# EAGLE design spachausgabe (EAGLE 7.3.0)
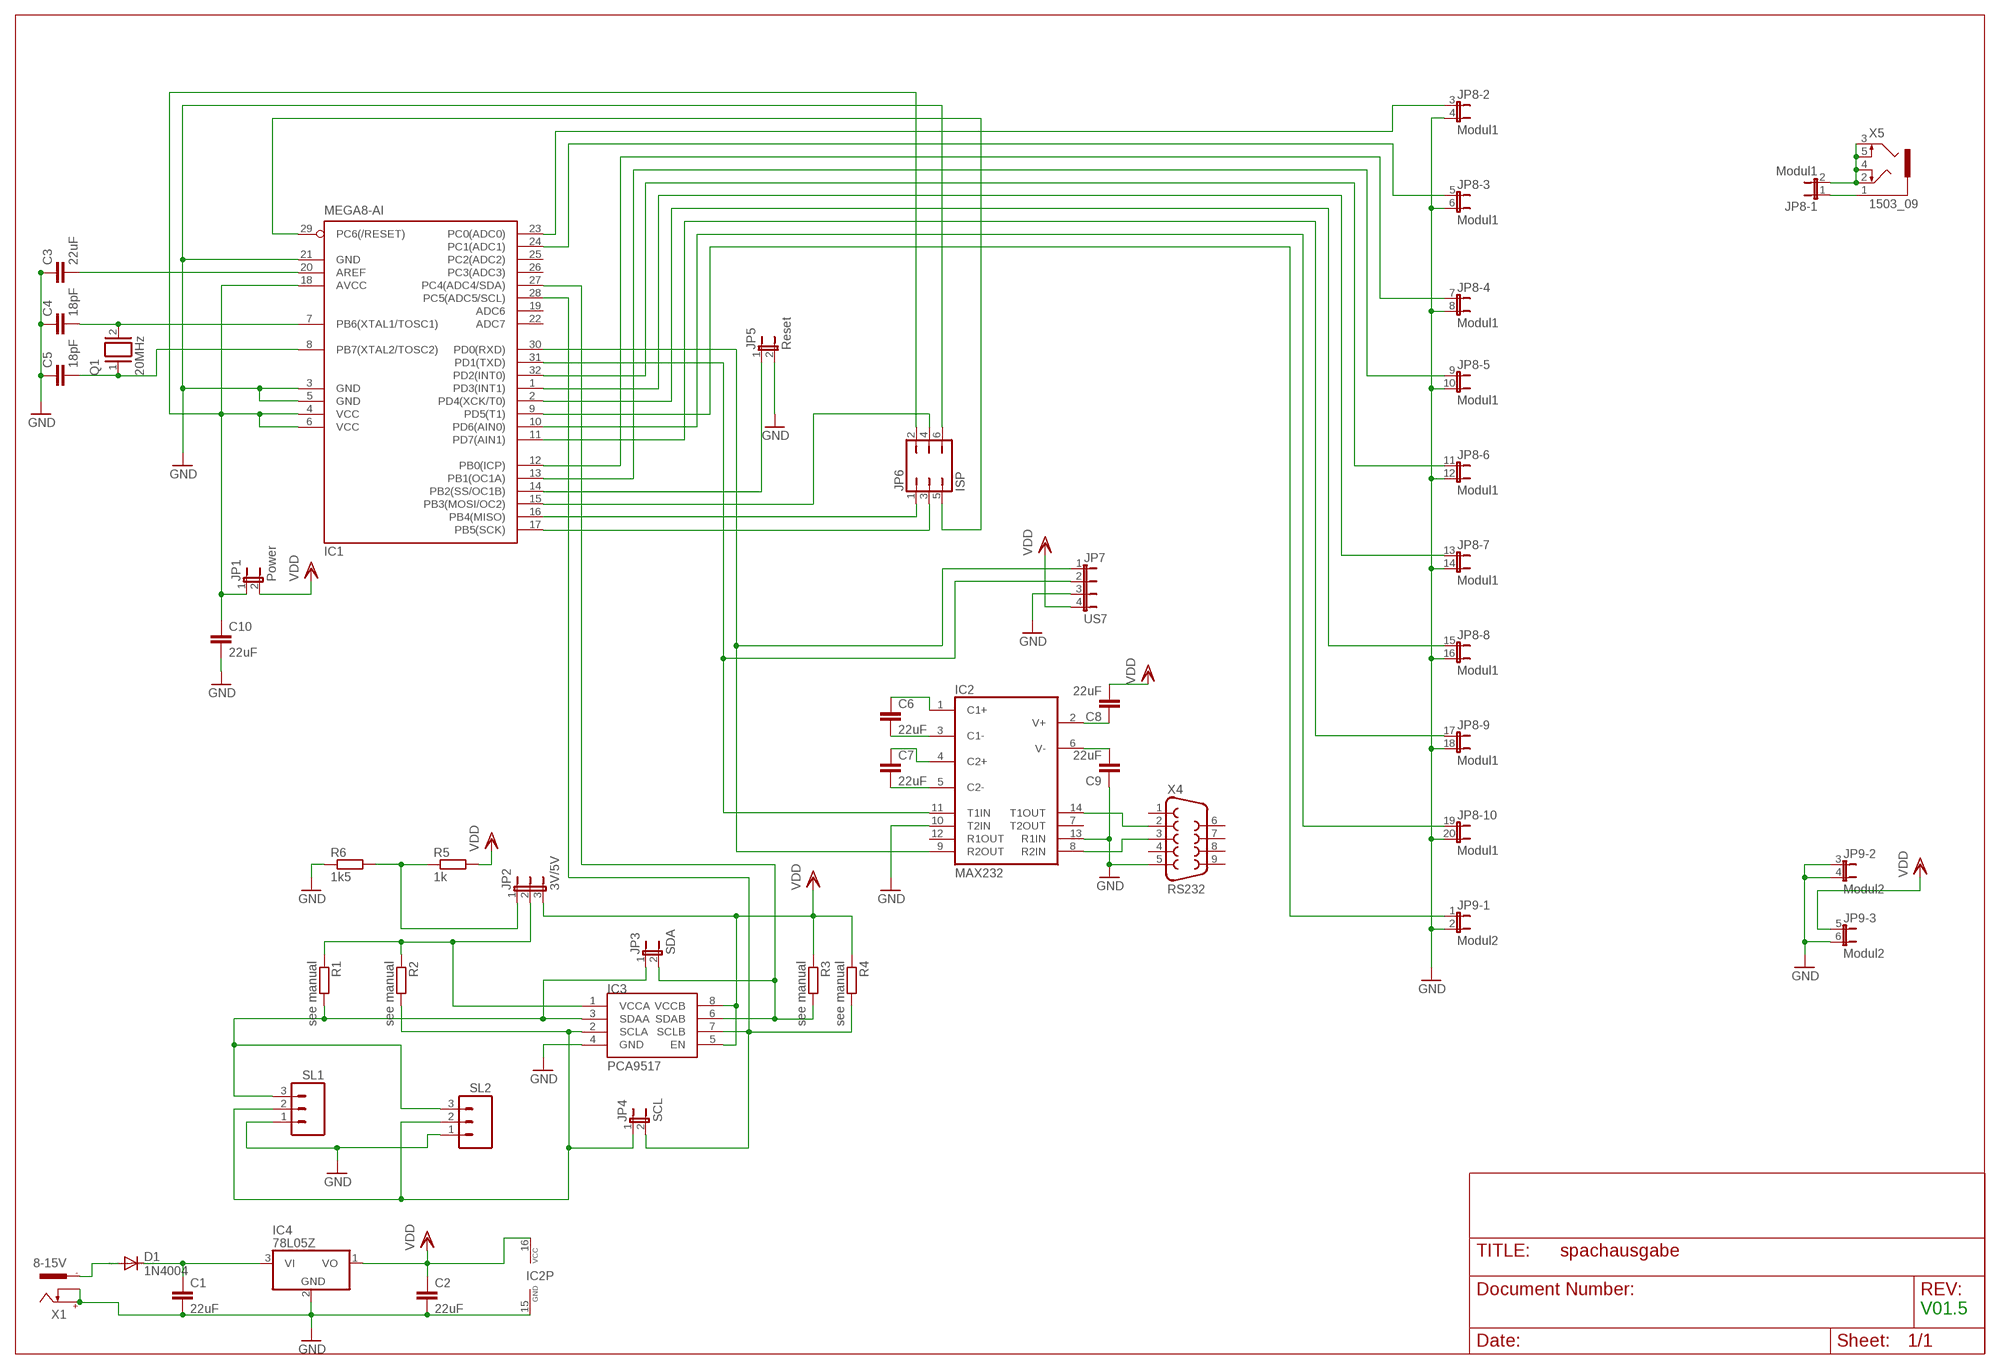
[diagram p0: schematic, sheet 1]

## Parts
C1  22uF  C-EUC1206  [C1206]
C2  22uF  C-EUC1206  [C1206]
C3  22uF  C-EUC1206  [C1206]
C4  18pF  C-EU025-025X050  [C025-025X050]
C5  18pF  C-EU025-025X050  [C025-025X050]
C6  22uF  C-EUC1206  [C1206]
C7  22uF  C-EUC1206  [C1206]
C8  22uF  C-EUC1206  [C1206]
C9  22uF  C-EUC1206  [C1206]
C10  22uF  C-EUC1206  [C1206]
D1  1N4004  [DO41-10]
IC1  MEGA8-AI  [TQFP32-08]
IC2  MAX232  [DIL16]
IC3  PCA9517  [SO-08]
IC4  78L05Z  [TO92]
JP1  Power  JP1E  [JP1]
JP2  3V/5V  JP2E  [JP2]
JP3  SDA  JP1E  [JP1]
JP4  SCL  JP1E  [JP1]
JP5  Reset  JP1E  [JP1]
JP6  ISP  JP3Q  [JP3Q]
JP7  US7  JP4E  [JP4]
JP8  Modul1  JP10QE  [JP10Q]
JP9  Modul2  JP3QE  [JP3Q]
Q1  20MHz  XTAL/S  [QS]
R1  see manual  R-EU_R1206  [R1206]
R2  see manual  R-EU_M1206  [M1206]
R3  see manual  R-EU_R1206  [R1206]
R4  see manual  R-EU_R1206  [R1206]
R5  1k  R-EU_R1206  [R1206]
R6  1k5  R-EU_R1206  [R1206]
SL1  M03  [03P]
SL2  M03  [03P]
X1  8-15V  737992-55  [737992-5]
X4  RS232  F09H  [F09H]
X5  1503_09  [1503_09]

## Nets
C13: C6.1 IC2.1(C1+)
GND: C1.2 C2.2 C3.1 C4.1 C5.1 C9.1 C10.2 IC1.3(GND) IC1.5(GND) IC1.21(GND) IC2.10(T2IN) IC2.13(R1IN) IC2.15(GND) IC3.4(GND) IC4.2(GND) JP5.2 JP6.6 JP7.3 JP8.4 JP8.6 JP8.8 JP8.10 JP8.12 JP8.14 JP8.16 JP8.18 JP8.20 JP9.2 JP9.3 JP9.4 JP9.6 R6.1 SL1.1 SL2.1 X1.+ X1.K X4.5
N$1: IC1.10(PD6(AIN0)) JP8.19
N$2: IC1.30(PD0(RXD)) IC2.9(R2OUT) JP7.1
N$3: C7.2 IC2.5(C2-)
N$4: IC2.14(T1OUT) X4.2
N$5: IC1.27(PC4(ADC4/SDA)) IC3.6(SDAB) JP3.2 R3.2
N$6: IC1.14(PB2(SS/OC1B)) JP5.1
N$7: IC1.11(PD7(AIN1)) JP8.17
N$8: IC3.3(SDAA) JP3.1 R1.2 SL1.3 SL2.3
N$9: IC2.8(R2IN) X4.3
N$10: IC3.2(SCLA) JP4.1 R2.2 SL1.2 SL2.2
N$11: IC3.1(VCCA) JP2.2 R1.1 R2.1
N$12: IC1.31(PD1(TXD)) IC2.11(T1IN) JP7.2
N$13: C7.1 IC2.4(C2+)
N$14: C6.2 IC2.3(C1-)
N$15: IC1.16(PB4(MISO)) JP6.1
N$16: C8.1 IC2.2(V+)
N$17: C9.2 IC2.6(V-)
N$18: IC1.29(PC6(/RESET)) JP6.5
N$19: C4.2 IC1.7(PB6(XTAL1/TOSC1)) Q1.2
N$20: IC1.17(PB5(SCK)) JP6.3
N$21: JP2.1 R5.1 R6.2
N$22: IC1.28(PC5(ADC5/SCL)) IC3.7(SCLB) JP4.2 R4.2
N$23: IC1.2(PD4(XCK/T0)) JP8.15
N$25: IC1.24(PC1(ADC1)) JP8.5
N$26: IC1.12(PB0(ICP)) JP8.7
N$27: D1.A X1.-1
N$28: IC1.15(PB3(MOSI/OC2)) JP6.4
N$29: C3.2 IC1.20(AREF)
N$30: IC1.9(PD5(T1)) JP9.1
N$33: C1.1 D1.C IC4.3(VI)
N$34: IC1.23(PC0(ADC0)) JP8.3
N$37: C5.2 IC1.8(PB7(XTAL2/TOSC2)) Q1.1
N$39: IC1.13(PB1(OC1A)) JP8.9
N$44: C10.1 IC1.4(VCC) IC1.6(VCC) IC1.18(AVCC) JP1.1 JP6.2
N$51: IC1.1(PD3(INT1)) JP8.13
N$52: IC1.32(PD2(INT0)) JP8.11
N$60: JP8.1 X5.1
N$61: JP8.2 X5.2 X5.3 X5.4 X5.5
VDD: C2.1 C8.2 IC2.16(VCC) IC3.5(EN) IC3.8(VCCB) IC4.1(VO) JP1.2 JP2.3 JP7.4 JP9.5 R3.1 R4.1 R5.2
Unconnected: IC1.19(ADC6) IC1.22(ADC7) IC1.25(PC2(ADC2)) IC1.26(PC3(ADC3)) IC2.7(T2OUT) IC2.12(R1OUT) X1.-2 X4.1 X4.4 X4.6 X4.7 X4.8 X4.9

## Notes on the sheet
- V01.5

## Library data of the parts
C1-C3 C6-C10 = rcl:C-EU: CAPACITOR, European symbol
C4 C5 = resistor:C-EU: CAPACITOR, European symbol
D1 = diode:1N4004: DIODE general purpose rectifier, 1 A
IC1 = atmel:MEGA8: MICROCONTROLLER 8 Kbytes FLASH, 1 kbytes SRAM, 512 bytes EEPROM, USART, 6-channel 10 bit ADC, 2-channel 8 bit ADC Pin compatible with Atmega48, ATMega88, ATMega168 Source: avr.lbr; MPN: ATMEGA8-16AU; OC_FARNELL: 9171371; OC_NEWARK: 73M8863
IC2 = maxim:MAX232: RS232 TRANSCEIVER; MF: MAXIM; MPN: MAX232ACPE+; OC_FARNELL: 9723773; OC_NEWARK: 68K4544
IC3 = PCA9517:PCA9517: PCA9517
IC4 = linear:78*: Positive VOLTAGE REGULATOR Source: http://cache.national.com/ds/LM/LM78L05.pdf http://www.fairchildsemi.com/ds/LM/LM7805.pdf
JP1 JP3-JP5 = jumper:JP1E: JUMPER
JP2 = jumper:JP2E: JUMPER
JP6 = jumper:JP3Q: JUMPER
JP7 = jumper:JP4E: JUMPER
JP8 = jumper:JP10QE: JUMPER
JP9 = jumper:JP3QE: JUMPER
Q1 = special:XTAL/S: CRYSTAL
R1-R6 = resistor:R-EU_: RESISTOR, European symbol
SL1 SL2 = con-amp-quick:M03: AMP QUICK CONNECTOR; OC_FARNELL: unknown; OC_NEWARK: unknown
X1 = con-conrad:737992-55: FEMALE PRINT CONNECTOR DIN 45323 (34V/3A), ROKA, distributor Conrad
X4 = con-subd:F09: SUB-D; OC_FARNELL: unknown; OC_NEWARK: unknown
X5 = con-lumberg:1503_09: Jack connectors according to JISC 6560, 3.5 mm Klinkeneinbaukupplung nach JISC 6560, 3,5 mm, 3-polig/ stereo, abgewinkelte Ausführung, mit 2 Öffnern und Lötaugen, für Leiterplatten Rückseitenmontage Source: http://www.lumberg.com/Produkte/PDFs/1503_09.pdf; OC_FARNELL: 1243244; OC_NEWARK: unknown

## Board
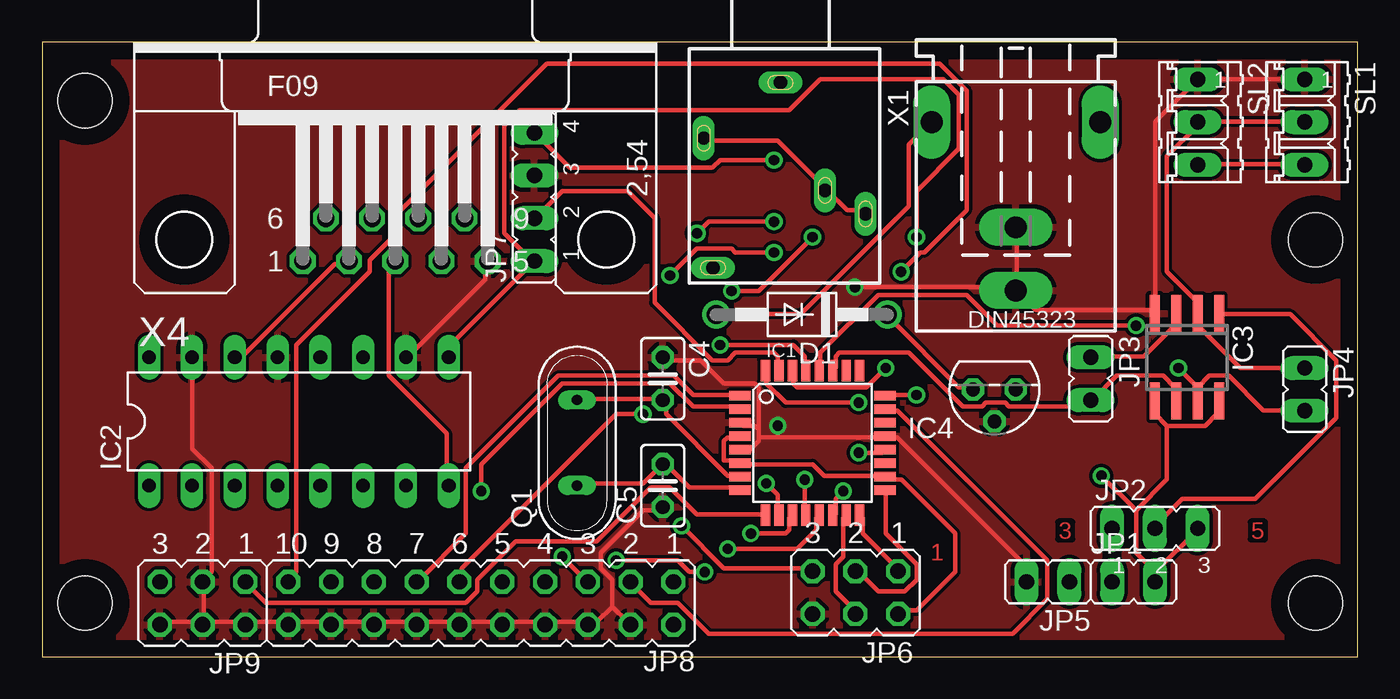
[diagram p1: board, top side]
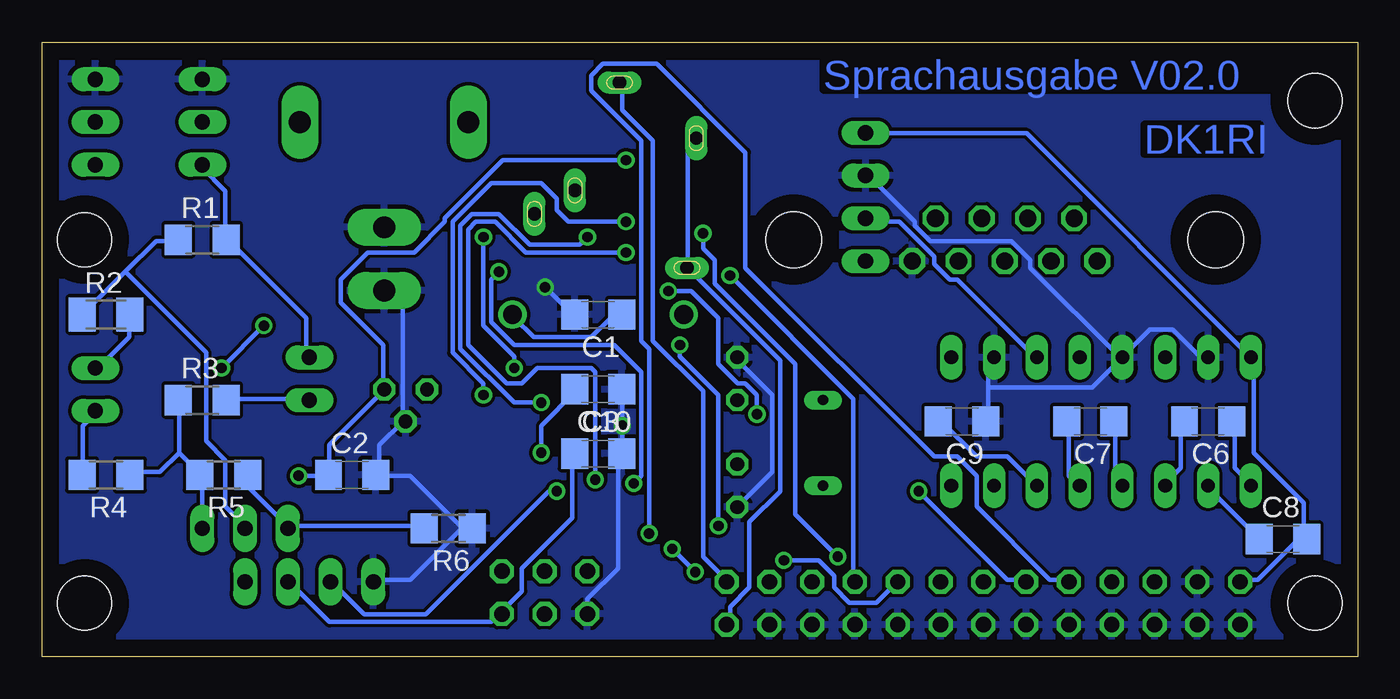
[diagram p2: board, bottom side, seen from below]

Size 78.08 x 36.5 mm. Coordinates in mm from the lower left corner, seen from the top.
Outline: 0,0 78.08,0 78.08,36.5 0,36.5 0,0
Copper layers (1*16): Top 0.035mm / dielectric 1.5mm / Bottom 0.035mm
Design rules "default": minimum track width 10mil, minimum drill 24mil, track to track 8mil, track to pad 8mil, pad to pad 8mil, via to via 8mil, smd to smd 8mil, copper to edge 40mil, drill to drill 8mil, minimum pad ring 10mil, minimum via ring 8mil, stop-mask expansion 4mil, vias tented up to drill 0mil, thermal gap 10mil
Holes 3.2 mm at 2.54,33.02 75.56,24.77 2.54,3.17 75.56,3.17

### Footprints (pad centres in the part's own frame; a part is rotated, then mirrored left to right if it is on the bottom)
C1206 = smd 1.6 x 1.8: 1 -1.4,0; 2 1.4,0
C025-025X050 = drill 0.813 octagon: 1 -1.27,0; 2 1.27,0
DO41-10 = drill 1.118: A 5.08,0; C -5.08,0
TQFP32-08 = smd 1.27 x 0.559: 1 -4.293,2.8; 2 -4.293,2; 3 -4.293,1.2; 4 -4.293,0.4; 5 -4.293,-0.4; 6 -4.293,-1.2; 7 -4.293,-2; 8 -4.293,-2.8; 17 4.293,-2.8; 18 4.293,-2; 19 4.293,-1.2; 20 4.293,-0.4; 21 4.293,0.4; 22 4.293,1.2; 23 4.293,2; 24 4.293,2.8 | smd 0.559 x 1.27: 9 -2.8,-4.293; 10 -2,-4.293; 11 -1.2,-4.293; 12 -0.4,-4.293; 13 0.4,-4.293; 14 1.2,-4.293; 15 2,-4.293; 16 2.8,-4.293; 25 2.8,4.293; 26 2,4.293; 27 1.2,4.293; 28 0.4,4.293; 29 -0.4,4.293; 30 -1.2,4.293; 31 -2,4.293; 32 -2.8,4.293
DIL16 = drill 0.813 long: 1 -8.89,-3.81; 2 -6.35,-3.81; 3 -3.81,-3.81; 4 -1.27,-3.81; 5 1.27,-3.81; 6 3.81,-3.81; 7 6.35,-3.81; 8 8.89,-3.81; 9 8.89,3.81; 10 6.35,3.81; 11 3.81,3.81; 12 1.27,3.81; 13 -1.27,3.81; 14 -3.81,3.81; 15 -6.35,3.81; 16 -8.89,3.81
SO-08 = smd 0.6 x 2.2: 1 -1.905,-2.6; 2 -0.635,-2.6; 3 0.635,-2.6; 4 1.905,-2.6; 5 1.905,2.6; 6 0.635,2.6; 7 -0.635,2.6; 8 -1.905,2.6
TO92 = drill 0.813 octagon: 1 -1.27,0; 2 0,1.905; 3 1.27,0
JP1 = drill 0.914 long: 1 0,-1.27; 2 0,1.27
JP2 = drill 0.914 long: 1 -2.54,0; 2 0,0; 3 2.54,0
JP3Q = drill 0.914 octagon: 1 -2.54,-1.27; 2 -2.54,1.27; 3 0,-1.27; 4 0,1.27; 5 2.54,-1.27; 6 2.54,1.27
JP4 = drill 0.914 long: 1 -3.81,0; 2 -1.27,0; 3 1.27,0; 4 3.81,0
JP10Q = drill 0.914 octagon: 1 -11.43,-1.27; 2 -11.43,1.27; 3 -8.89,-1.27; 4 -8.89,1.27; 5 -6.35,-1.27; 6 -6.35,1.27; 7 -3.81,-1.27; 8 -3.81,1.27; 9 -1.27,-1.27; 10 -1.27,1.27; 11 1.27,-1.27; 12 1.27,1.27; 13 3.81,-1.27; 14 3.81,1.27; 15 6.35,-1.27; 16 6.35,1.27; 17 8.89,-1.27; 18 8.89,1.27; 19 11.43,-1.27; 20 11.43,1.27
QS = drill 0.61 long: 1 -2.54,0; 2 2.54,0
R1206 = smd 1.6 x 1.803: 1 -1.422,0; 2 1.422,0
M1206 = smd 1.6 x 2: 1 -1.4,0; 2 1.4,0
03P = drill 0.914 long: 1 -2.54,0; 2 0,0; 3 2.54,0
737992-5 = drill 1.3 pad 2.184 long: + 0,10; -1 5,0; -2 -5,0; K 0,6.25
F09H = drill 1.016 octagon: 1 -5.486,-1.27; 2 -2.743,-1.27; 3 0,-1.27; 4 2.743,-1.27; 5 5.486,-1.27; 6 -4.115,1.27; 7 -1.372,1.27; 8 1.372,1.27; 9 4.115,1.27 | hole 3.302: -12.522,0; 12.522,0
1503_09 = drill 0.8 pad 1.2 long: 1 0,-2.1; 2 -4.55,-5.4; 3 5.05,-9.9; 4 -4,-13.1; 5 2.65,-8.5

### Placement (x,y rotation side)
C1  45.09,20.32 180 bottom
C2  59.69,10.79 0 bottom
C3  45.09,15.88 180 bottom
C4  36.83,16.51 270 top
C5  36.83,10.16 90 top
C6  8.89,13.97 180 bottom
C7  15.88,13.97 180 bottom
C8  4.45,6.99 0 bottom
C9  23.5,13.97 180 bottom
C10  45.09,12.06 0 bottom
D1  45.09,20.32 180 top
IC1  45.72,12.7 0 top
IC2  15.24,13.97 0 top
IC3  67.94,17.78 180 top
IC4  56.52,15.88 180 top
JP1  64.77,4.45 270 top
JP2  66.04,7.62 0 top
JP3  62.23,16.51 180 top
JP4  74.93,15.88 180 top
JP5  59.69,4.45 90 top
JP6  48.26,3.81 180 top
JP7  29.21,27.3 90 top
JP8  26.04,3.17 180 top
JP9  9.53,3.17 180 top
Q1  31.75,12.7 90 top
R1  68.58,24.77 0 bottom
R2  74.3,20.32 0 bottom
R3  68.58,15.24 0 bottom
R4  74.3,10.79 180 bottom
R5  67.31,10.79 180 bottom
R6  53.98,7.62 180 bottom
SL1  74.93,31.75 270 top
SL2  68.58,31.75 270 top
X1  57.78,31.75 180 top
X4  20.95,24.77 0 top
X5  43.81,36.2 0 top

### Tracks (layer width: path | path; a pad name or v marks a point on that pad's centre or on a via)
C13
  Bottom 0.254: C6.1 7.32,13.95 7.32,11.2 6.4,10.29 IC2.1
GND  (via drill 0.61)
  Top 0.254: SL1.1 SL2.1 66.06,31.77 66.06,20.57 IC3.4 65.84,20.57 58.98,20.57 57.84,21.72 X1.+ | v48.23,21.95 57.61,21.95 X1.+ | X1.K 57.84,25.38 57.84,21.95 X1.+ | X4.5 26.29,23.32 26.29,22.4 21.72,17.83 IC2.10 | 42.52,13.49 42.52,13.03 | 42.52,13.03 42.52,12.8 42.06,12.34 41.6,12.34 IC1.5 | 42.52,13.49 42.29,13.72 41.6,13.72 IC1.3 | 42.52,13.03 43.66,13.03 | 43.66,13.03 49.84,13.03 IC1.21 50.06,13.03 50.75,13.03 58.29,5.49 58.29,4.57 JP5.2 | 42.52,13.49 42.52,16 42.29,16.23 40.46,16.23 39.09,17.6 37.03,17.6 C4.1 | 43.66,13.03 v43.66,13.72 | JP9.6 7.09,2.06 9.37,2.06 JP9.4 9.6,2.06 | 9.6,2.06 9.6,4.34 JP9.3 9.6,4.57 10.06,5.03 10.06,11.2 8.91,12.34 8.91,17.6 IC2.15 | 17.14,2.06 14.63,2.06 JP8.20 14.4,2.06 12.12,2.06 JP9.2 11.89,2.06 9.6,2.06 | 33.83,2.97 33.83,4.57 33.15,5.26 33.15,6.17 35.66,8.69 36.8,8.69 C5.1 | 33.83,2.97 34.75,2.06 JP8.4 | 33.83,2.97 32.92,2.06 32.46,2.06 JP8.6 32.23,2.06 29.95,2.06 JP8.8 29.72,2.06 27.43,2.06 JP8.10 27.2,2.06 24.92,2.06 JP8.12 24.69,2.06 22.4,2.06 JP8.14 22.17,2.06 19.89,2.06 JP8.16 19.66,2.06 17.14,2.06 | 17.14,2.06 JP8.18
  Bottom 0.254: 53.03,7.77 53.26,7.77 56.24,10.74 58.06,10.74 C2.2 58.06,10.97 58.06,12.57 56.69,13.95 IC4.2 56.69,14.17 56.69,20.8 57.61,21.72 X1.+ | 53.03,7.77 52.58,7.77 R6.1 53.03,7.77 | 53.03,7.77 56.24,4.57 58.29,4.57 JP5.2 | v48.23,21.95 46.63,20.34 C1.2 | 21.95,16 21.95,17.37 21.72,17.6 IC2.10 | 21.95,16 21.95,14.17 C9.1 | IC2.15 8.91,17.83 9.37,17.83 10.97,19.43 12.34,19.43 13.95,17.83 IC2.13 | JP7.3 29.03,28.57 26.29,25.83 26.29,25.6 25.38,24.69 20.57,24.69 19.43,23.55 19.43,23.09 14.17,17.83 IC2.13 | 21.95,16 15.77,16 14.17,17.6 IC2.13 | C3.1 43.66,15.77 v43.66,13.72 43.66,12.12 C10.2 43.89,11.89 43.89,5.26 45.72,3.43 JP6.6 | C5.1 34.75,10.97 34.75,15.54 36.8,17.6 C4.1
  pour Top: 0.64,35.56 77.47,35.56 77.47,0.64 0.64,0.64
  pour Bottom: 0.64,35.56 77.47,35.56 77.47,0.64 0.64,0.64
N$1  (via drill 0.61)
  Top 0.254: v42.98,10.29 43.66,9.6 43.66,8.46 IC1.10 | v50.98,22.86 52.12,24 52.35,24 54.86,26.52 54.86,33.6 53.26,35.2 29.95,35.2 20.8,26.06 20.8,24.92 19.43,23.55 19.43,22.86 15.09,18.52 15.09,5.03 14.63,4.57 JP8.19
  Bottom 0.254: v42.98,10.29 42.52,10.74 42.52,16.92 44.12,18.52 50.06,18.52 51.44,19.89 51.44,22.4 v50.98,22.86
N$2  (via drill 0.61)
  Top 0.254: v50.06,17.14 48.92,16 44.81,16 44.58,16.23 44.58,16.92 IC1.30 | v51.89,24.92 51.89,27.66 54.41,30.18 54.41,33.38 53.49,34.29 46.18,34.29 44.35,32.46 28.35,32.46 27.43,31.55 27.43,25.15 29.03,23.55 JP7.1 24.23,18.52 24.23,17.83 IC2.9
  Bottom 0.254: v50.06,17.14 50.06,17.83 51.89,19.66 v51.89,24.92
N$3
  Bottom 0.254: C7.2 17.14,13.95 17.14,10.74 16.69,10.29 IC2.5
N$4
  Top 0.254: IC2.14 11.43,17.83 11.89,17.83 17.37,23.32 18.06,23.32 X4.2
N$5
  Top 0.254: IC1.27 47.09,17.14 47.09,17.83 47.32,18.06 51.44,18.06 54.63,14.86 55.78,14.86 56.01,15.09 57.15,15.09 57.38,14.86 61.95,14.86 62.18,15.09 JP3.2 62.41,15.32 63.78,16.69 66.52,16.69 67.21,16 67.21,15.32 IC3.6
  Bottom 0.254: R3.2 66.98,15.32 62.41,15.32 JP3.2
N$6  (via drill 0.61)
  Top 0.254: v47.55,9.83 47.09,9.37 47.09,8.46 IC1.14
  Bottom 0.254: v47.55,9.83 48.01,9.83 55.32,2.52 58.98,2.52 60.81,4.34 JP5.1
N$7  (via drill 0.61)
  Top 0.254: v42.06,7.32 44.12,7.32 44.35,7.54 44.35,8.23 IC1.11
  Bottom 0.254: v42.06,7.32 42.06,18.29 42.52,18.75 42.52,30.63 45.49,33.6 45.49,34.52 44.81,35.2 41.6,35.2 36.35,29.95 36.35,23.09 25.15,11.89 23.77,11.89 22.63,10.74 22.63,8.91 18.29,4.57 17.14,4.57 JP8.17
N$8
  Top 0.254: IC3.3 67.21,20.34 67.21,19.66 65.38,17.83 62.41,17.83 JP3.1 | SL1.3 74.75,29.26 68.58,29.26 SL2.3
  Bottom 0.254: SL2.3 68.58,29.03 67.21,27.66 67.21,24.92 R1.2 66.98,24.69 62.41,20.12 62.41,17.83 JP3.1
N$9
  Top 0.254: IC2.8 24,10.29 24,13.26 20.57,16.69 20.57,23.09 20.8,23.32 X4.3
N$10
  Top 0.254: SL1.2 74.75,31.77 68.58,31.77 SL2.2 68.58,31.55 66.75,29.72 66.75,22.86 68.58,21.03 IC3.2 68.58,19.66 71.09,17.14 JP4.1
  Bottom 0.254: R2.2 72.92,20.12 72.92,18.97 74.75,17.14 JP4.1
N$11
  Top 0.254: IC3.1 69.95,20.34 74.07,20.34 76.81,17.6 76.81,14.17 72.01,9.37 67.67,9.37 66.06,7.77 JP2.2
  Bottom 0.254: 73.15,22.86 75.67,20.34 R2.1 | 73.15,22.86 71.32,24.69 70.18,24.69 R1.1 | 73.15,22.86 68.35,18.06 68.35,12.8 67.21,11.66 67.21,8.91 66.06,7.77 JP2.2
N$12
  Top 0.254: IC1.31 43.66,17.14 43.66,17.83 43.43,18.06 41.15,18.06 40.69,17.6 39.78,17.6 36.35,21.03 36.35,26.06 34.75,27.66 30.86,27.66 29.26,26.06 JP7.2
  Bottom 0.254: IC2.11 19.2,17.83 23.77,22.4 24.23,22.4 25.15,23.32 25.15,23.77 27.2,25.83 29.03,25.83 JP7.2
N$13
  Bottom 0.254: C7.1 14.4,13.95 14.4,10.52 14.17,10.29 IC2.4
N$14
  Bottom 0.254: C6.2 10.52,13.95 10.52,11.2 11.43,10.29 IC2.3
N$15
  Top 0.254: IC1.16 48.69,8.23 48.69,7.32 50.75,5.26 JP6.1
N$16
  Bottom 0.254: C8.1 5.94,7.09 8.91,10.06 IC2.2
N$17
  Bottom 0.254: C9.2 24.69,13.95 22.63,11.89 20.8,11.89 19.2,10.29 IC2.6
N$18  (via drill 0.61)
  Top 0.254: v40.23,18.52 44.58,18.52 45.26,17.83 45.26,17.14 IC1.29 | v37.95,7.77 40.46,5.26 45.72,5.26 JP6.5
  Bottom 0.254: v40.23,18.52 40.23,17.83 37.95,15.54 v37.95,7.77
N$19
  Top 0.254: IC1.7 41.38,10.74 40.69,10.74 37.03,14.4 37.03,15.09 C4.2 36.8,15.32 31.77,15.32 Q1.2
N$20
  Top 0.254: IC1.17 50.06,9.83 50.06,7.32 51.89,5.49 51.89,4.57 51.21,3.89 49.61,3.89 48.46,5.03 JP6.3
N$21
  Bottom 0.254: R6.2 55.55,7.77 63.32,7.77 JP2.1 63.55,7.77 65.84,10.06 65.84,10.74 R5.1
N$22  (via drill 0.61)
  Top 0.254: v64.92,19.66 56.69,19.66 54.86,21.49 49.61,21.49 46.18,18.06 46.18,17.14 IC1.28 | 68.58,16 v67.44,17.14 | 68.58,16 IC3.7 68.58,15.32 | 68.58,16 69.27,16.69 70.41,16.69 72.47,14.63 74.75,14.63 JP4.2
  Bottom 0.254: R4.2 75.67,10.97 75.67,13.72 74.98,14.4 JP4.2 | v67.44,17.14 v64.92,19.66
N$23  (via drill 0.61)
  Top 0.254: v26.06,9.83 26.06,11.43 30.86,16.23 37.26,16.23 38.63,14.86 41.38,14.86 IC1.2
  Bottom 0.254: v26.06,9.83 20.8,4.57 19.89,4.57 JP8.15
N$25  (via drill 0.61)
  Top 0.254: v51.89,15.54 50.06,15.54 IC1.24 | v43.43,25.83 39.55,25.83 v38.86,25.15 | v30.86,5.94 32.23,4.57 JP8.5
  Bottom 0.254: v51.89,15.54 51.89,16.23 53.72,18.06 53.72,25.83 51.44,28.12 48.46,28.12 47.55,27.2 47.55,26.52 46.86,25.83 v43.43,25.83 | v38.86,25.15 38.86,24.23 38.18,23.55 38.18,22.17 33.38,17.37 33.38,8.46 v30.86,5.94
N$26  (via drill 0.61)
  Top 0.254: v45.26,10.52 45.26,8.46 IC1.12 | v43.43,24 41.15,24 40.92,24.23 38.86,24.23 v37.26,22.63
  Bottom 0.254: v45.26,10.52 45.26,16.92 45.49,17.14 48.69,17.14 49.61,16.23 50.52,16.23 52.81,18.52 52.81,25.38 52.35,25.83 51.21,25.83 49.38,24 v43.43,24 | v37.26,22.63 29.95,15.32 29.95,4.57 JP8.7
N$27
  Top 0.254: D1.A 40.01,20.34 45.03,20.34 51.44,26.75 51.44,30.4 52.58,31.55 X1.-1
N$28
  Top 0.254: IC1.15 47.55,8.23 47.55,5.94 47.09,5.49 47.09,3.89 48.23,2.74 JP6.4
N$29  (via drill 0.61)
  Top 0.254: v48.46,12.12 49.84,12.12 IC1.20
  Bottom 0.254: v48.46,12.12 48.46,13.72 46.41,15.77 C3.2
N$30
  Top 0.254: IC1.9 42.75,8.46 38.86,8.46 37.26,10.06 36.12,10.06 32.92,6.86 28.12,6.86 25.83,4.57 25.83,3.89 25.15,3.2 13.26,3.2 12.12,4.34 JP9.1
N$33
  Top 0.254: IC4.3 55.09,16 54.41,16 50.29,20.12 D1.C
  Bottom 0.254: C1.1 43.89,20.12 44.35,20.12 45.49,18.97 48.92,18.97 50.06,20.12 D1.C
N$34
  Top 0.254: IC1.23 50.06,14.63 50.75,14.63 59.66,5.71 59.66,3.43 57.61,1.37 39.55,1.37 37.72,3.2 36.12,3.2 34.98,4.34 JP8.3
N$37
  Top 0.254: IC1.8 41.38,10.06 38.41,10.06 37.03,11.43 C5.2 36.8,11.43 35.66,10.29 31.77,10.29 Q1.1
N$39  (via drill 0.61)
  Top 0.254: v40.69,6.4 44.81,6.4 45.95,7.54 45.95,8.23 IC1.13 | v39.32,5.03 38.41,5.03 37.72,5.71 v34.06,5.71
  Bottom 0.254: v39.32,5.03 v40.69,6.4 | v34.06,5.71 32,5.71 31.09,4.8 31.09,4.12 30.18,3.2 28.57,3.2 27.43,4.34 JP8.9
N$44
  Top 0.254: IC1.4 41.38,13.03 40.69,13.03 40.46,12.8 40.46,11.66 41.38,11.66 IC1.6 41.6,11.43 45.72,11.43 46.41,10.74 49.84,10.74 IC1.18 50.06,10.52 50.98,10.52 54.18,7.32 54.18,5.03 51.89,2.74 50.98,2.74 JP6.2
  Bottom 0.254: C10.1 46.63,11.89 46.63,8.23 49.61,5.26 49.61,3.89 50.75,2.74 JP6.2 50.98,2.52 51.44,2.06 61.04,2.06 63.32,4.34 JP1.1
N$51
  Top 0.254: IC1.1 41.38,15.54 38.63,15.54 37.49,16.69 30.63,16.69 25.15,11.2 25.15,7.32 22.4,4.57 JP8.13
N$52  (via drill 0.61)
  Top 0.254: v48.46,15.09 44.12,15.09 42.98,16.23 42.98,16.92 IC1.32 | v45.72,24.92 42.52,21.72 v40.92,21.72 | v35.66,14.4 34.06,14.4 24.92,5.26 24.92,4.57 JP8.11
  Bottom 0.254: v48.46,15.09 50.06,15.09 53.26,18.29 53.26,25.6 52.58,26.29 50.98,26.29 49.15,24.46 46.18,24.46 v45.72,24.92 | v40.92,21.72 39.55,21.72 37.95,20.12 37.95,17.37 36.8,16.23 36.35,16.23 35.66,15.54 v35.66,14.4
N$60
  Bottom 0.254: X5.1 43.66,34.06 43.66,32.46 41.83,30.63 41.83,18.75 38.86,15.77 38.86,5.94 37.49,4.57 JP8.1
N$61
  Top 0.254: X5.3 48.69,26.52 47.78,26.52 46.63,27.66 X5.5 46.41,27.89 43.66,30.63 39.32,30.63 X5.2
  Bottom 0.254: X5.2 39.32,30.63 39.78,30.18 39.78,23.32 X5.4 39.78,23.09 34.29,17.6 34.29,9.83 36.12,8 36.12,4.12 37.26,2.97 37.26,2.06 JP8.2
VDD  (via drill 0.61)
  Top 0.254: 66.75,13.72 66.06,14.4 66.06,15.09 IC3.5 | 66.75,13.72 69.04,13.72 69.72,14.4 69.72,15.09 IC3.8 | 66.06,5.03 66.06,4.57 JP1.2 66.06,5.03 | 66.06,5.03 68.58,7.54 JP2.3 | 66.75,13.72 66.75,10.52 64.92,8.69 | 64.92,8.69 64.92,6.17 66.06,5.03 | 64.92,8.69 v62.87,10.74 | v43.43,29.49 40.23,29.49 39.78,29.03 31.32,29.03 29.26,31.09 JP7.4
  Bottom 0.254: JP2.3 68.58,10.74 R5.2 68.81,10.97 69.95,12.12 | 69.95,12.12 69.95,15.09 R3.1 | 69.95,12.12 71.09,10.97 72.69,10.97 R4.1 | v62.87,10.74 61.27,10.74 C2.1 61.04,10.97 61.04,12.57 57.84,15.77 IC4.1 57.84,16 57.84,18.52 60.35,21.03 60.35,22.4 58.75,24 56.01,24 54.18,25.83 54.18,26.06 50.75,29.49 v43.43,29.49 | JP9.5 6.86,4.57 5.94,4.57 3.66,6.86 3.2,6.86 C8.2 3.2,7.09 3.2,9.14 6.17,12.12 6.17,17.6 IC2.16 19.66,31.09 29.03,31.09 JP7.4

### Text on the board
Top: 3 | 5 | 1
Bottom: Sprachausgabe V02.0 | DK1RI